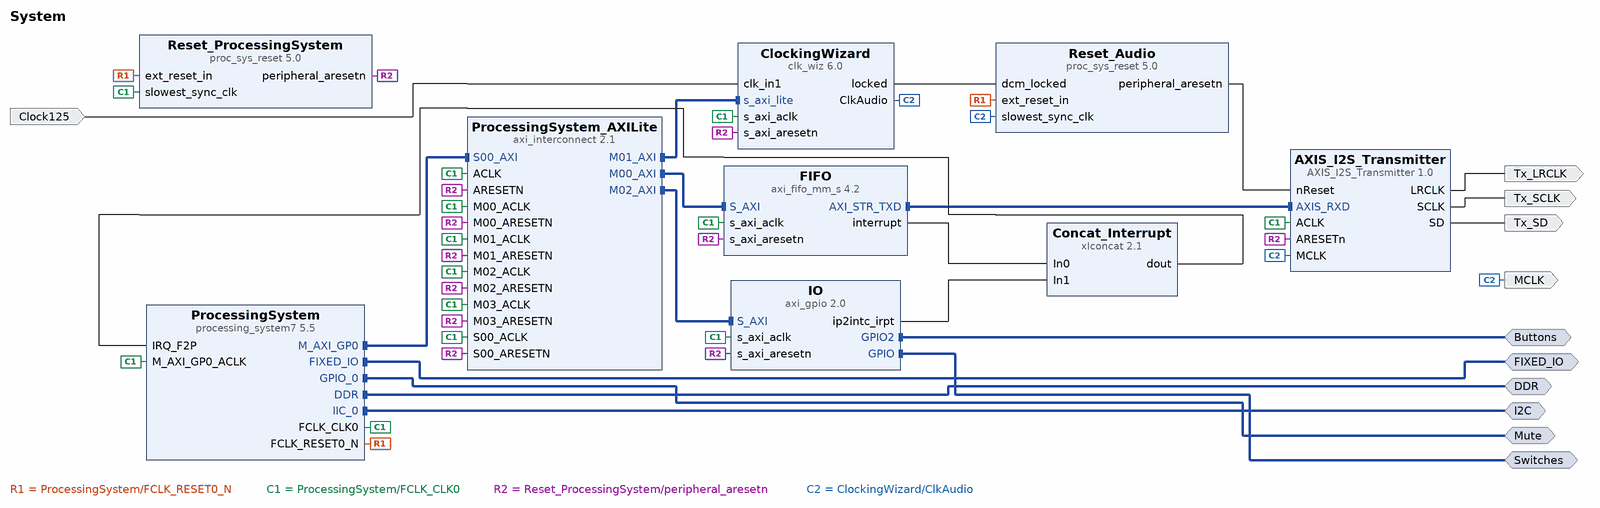
[diagram p0: block diagram of the top level]
# Vivado block design System, xc7z010clg400-1, Vivado 2019.2
create_bd_design System

create_bd_intf_port -mode Master -vlnv xilinx.com:interface:ddrx_rtl:1.0 DDR
create_bd_intf_port -mode Master -vlnv xilinx.com:display_processing_system7:fixedio_rtl:1.0 FIXED_IO
create_bd_intf_port -mode Master -vlnv xilinx.com:interface:gpio_rtl:1.0 Switches
create_bd_intf_port -mode Master -vlnv xilinx.com:interface:iic_rtl:1.0 I2C
create_bd_intf_port -mode Master -vlnv xilinx.com:interface:gpio_rtl:1.0 Buttons
create_bd_intf_port -mode Master -vlnv xilinx.com:interface:gpio_rtl:1.0 Mute
create_bd_port -dir I -type clk Clock125
set_property -dict {CONFIG.FREQ_HZ 125000000} [get_bd_ports Clock125]
create_bd_port -dir O Tx_LRCLK
create_bd_port -dir O Tx_SCLK
create_bd_port -dir O Tx_SD
create_bd_port -dir O -type clk MCLK
set_property -dict {CONFIG.FREQ_HZ 12286324} [get_bd_ports MCLK]

create_bd_cell -type ip -vlnv xilinx.com:ip:processing_system7:5.5 ProcessingSystem
set_property -dict [list \
  CONFIG.PCW_APU_PERIPHERAL_FREQMHZ 650.000000 \
  CONFIG.PCW_CRYSTAL_PERIPHERAL_FREQMHZ 50.000000 \
  CONFIG.PCW_ENET0_PERIPHERAL_ENABLE 0 \
  CONFIG.PCW_FCLK1_PERIPHERAL_CLKSRC {DDR PLL} \
  CONFIG.PCW_FCLK2_PERIPHERAL_CLKSRC {ARM PLL} \
  CONFIG.PCW_FPGA0_PERIPHERAL_FREQMHZ 100.000000 \
  CONFIG.PCW_FPGA1_PERIPHERAL_FREQMHZ 175.000000 \
  CONFIG.PCW_FPGA2_PERIPHERAL_FREQMHZ 12.288000 \
  CONFIG.PCW_FPGA3_PERIPHERAL_FREQMHZ 100.000000 \
  CONFIG.PCW_GPIO_EMIO_GPIO_ENABLE 1 \
  CONFIG.PCW_GPIO_EMIO_GPIO_IO 2 \
  CONFIG.PCW_GPIO_EMIO_GPIO_WIDTH 2 \
  CONFIG.PCW_GPIO_MIO_GPIO_ENABLE 1 \
  CONFIG.PCW_GPIO_MIO_GPIO_IO MIO \
  CONFIG.PCW_GPIO_PERIPHERAL_ENABLE 1 \
  CONFIG.PCW_I2C0_I2C0_IO EMIO \
  CONFIG.PCW_I2C0_PERIPHERAL_ENABLE 1 \
  CONFIG.PCW_I2C_PERIPHERAL_FREQMHZ 108.333336 \
  CONFIG.PCW_I2C_RESET_ENABLE 0 \
  CONFIG.PCW_IMPORT_BOARD_PRESET G:/Dropbox/Git/ZYBO/res/Zybo.xml \
  CONFIG.PCW_IRQ_F2P_INTR 1 \
  CONFIG.PCW_PRESET_BANK1_VOLTAGE {LVCMOS 1.8V} \
  CONFIG.PCW_QSPI_GRP_SINGLE_SS_ENABLE 1 \
  CONFIG.PCW_QSPI_GRP_SINGLE_SS_IO {MIO 1 .. 6} \
  CONFIG.PCW_QSPI_PERIPHERAL_ENABLE 1 \
  CONFIG.PCW_QSPI_QSPI_IO {MIO 1 .. 6} \
  CONFIG.PCW_SD0_GRP_CD_ENABLE 1 \
  CONFIG.PCW_SD0_GRP_CD_IO {MIO 47} \
  CONFIG.PCW_SD0_GRP_WP_ENABLE 1 \
  CONFIG.PCW_SD0_GRP_WP_IO EMIO \
  CONFIG.PCW_SD0_PERIPHERAL_ENABLE 1 \
  CONFIG.PCW_SD0_SD0_IO {MIO 40 .. 45} \
  CONFIG.PCW_SDIO_PERIPHERAL_FREQMHZ 50 \
  CONFIG.PCW_SINGLE_QSPI_DATA_MODE x4 \
  CONFIG.PCW_UART1_PERIPHERAL_ENABLE 1 \
  CONFIG.PCW_UART1_UART1_IO {MIO 48 .. 49} \
  CONFIG.PCW_UART_PERIPHERAL_FREQMHZ 50 \
  CONFIG.PCW_UIPARAM_DDR_FREQ_MHZ 525.000000 \
  CONFIG.PCW_UIPARAM_DDR_PARTNO {MT41K128M16 JT-125} \
  CONFIG.PCW_USB0_PERIPHERAL_ENABLE 0 \
  CONFIG.PCW_USB_RESET_ENABLE 0 \
  CONFIG.PCW_USE_FABRIC_INTERRUPT 1 \
] [get_bd_cells ProcessingSystem]
# 423 more settings of ProcessingSystem are not shown: defaults, MIO pin electricals, DDR timing, and values the tool derives
create_bd_cell -type ip -vlnv xilinx.com:ip:axi_fifo_mm_s:4.2 FIFO
set_property -dict {CONFIG.C_TX_FIFO_PE_THRESHOLD 5 CONFIG.C_USE_RX_DATA 0 CONFIG.C_USE_TX_CTRL 0} [get_bd_cells FIFO]
create_bd_cell -type ip -vlnv xilinx.com:ip:proc_sys_reset:5.0 Reset_ProcessingSystem
create_bd_cell -type ip -vlnv xilinx.com:ip:clk_wiz:6.0 ClockingWizard
set_property -dict [list \
  CONFIG.CLKOUT1_DRIVES BUFG \
  CONFIG.CLKOUT1_JITTER 273.836 \
  CONFIG.CLKOUT1_PHASE_ERROR 192.574 \
  CONFIG.CLKOUT1_REQUESTED_OUT_FREQ 12.288 \
  CONFIG.CLKOUT2_DRIVES BUFG \
  CONFIG.CLKOUT3_DRIVES BUFG \
  CONFIG.CLKOUT4_DRIVES BUFG \
  CONFIG.CLKOUT5_DRIVES BUFG \
  CONFIG.CLKOUT6_DRIVES BUFG \
  CONFIG.CLKOUT7_DRIVES BUFG \
  CONFIG.CLK_OUT1_PORT ClkAudio \
  CONFIG.MMCM_BANDWIDTH OPTIMIZED \
  CONFIG.MMCM_CLKFBOUT_MULT_F 23 \
  CONFIG.MMCM_CLKIN2_PERIOD 10.0 \
  CONFIG.MMCM_CLKOUT0_DIVIDE_F 78 \
  CONFIG.MMCM_COMPENSATION ZHOLD \
  CONFIG.MMCM_DIVCLK_DIVIDE 3 \
  CONFIG.PRIMITIVE PLL \
  CONFIG.RESET_PORT reset \
  CONFIG.RESET_TYPE ACTIVE_HIGH \
  CONFIG.USE_DYN_RECONFIG true \
  CONFIG.USE_RESET true \
] [get_bd_cells ClockingWizard]
create_bd_cell -type ip -vlnv xilinx.com:ip:proc_sys_reset:5.0 Reset_Audio
create_bd_cell -type ip -vlnv xilinx.com:ip:axi_interconnect:2.1 ProcessingSystem_AXILite
set_property -dict {CONFIG.NUM_MI 4} [get_bd_cells ProcessingSystem_AXILite]
create_bd_cell -type ip -vlnv xilinx.com:ip:axi_gpio:2.0 IO
set_property -dict [list \
  CONFIG.C_ALL_INPUTS 1 \
  CONFIG.C_ALL_INPUTS_2 1 \
  CONFIG.C_GPIO2_WIDTH 4 \
  CONFIG.C_GPIO_WIDTH 4 \
  CONFIG.C_INTERRUPT_PRESENT 1 \
  CONFIG.C_IS_DUAL 1 \
] [get_bd_cells IO]
create_bd_cell -type ip -vlnv xilinx.com:ip:xlconcat:2.1 Concat_Interrupt
create_bd_cell -type ip -vlnv www.Kampis-Elektroecke.com:Kampis-Elektroecke:AXIS_I2S_Transmitter:1.0 AXIS_I2S_Transmitter
set_property -dict {CONFIG.RATIO 8} [get_bd_cells AXIS_I2S_Transmitter]

# ---- connections ----

connect_bd_intf_net [get_bd_intf_ports FIXED_IO] [get_bd_intf_pins ProcessingSystem/FIXED_IO]
connect_bd_intf_net [get_bd_intf_ports Mute] [get_bd_intf_pins ProcessingSystem/GPIO_0]
connect_bd_intf_net -intf_net Mute_GPIO [get_bd_intf_ports Switches] [get_bd_intf_pins IO/GPIO]
connect_bd_intf_net [get_bd_intf_pins ProcessingSystem/M_AXI_GP0] [get_bd_intf_pins ProcessingSystem_AXILite/S00_AXI]
connect_bd_intf_net [get_bd_intf_pins ProcessingSystem_AXILite/M00_AXI] [get_bd_intf_pins FIFO/S_AXI]
connect_bd_intf_net [get_bd_intf_pins ProcessingSystem_AXILite/M02_AXI] [get_bd_intf_pins IO/S_AXI]
connect_bd_intf_net [get_bd_intf_ports I2C] [get_bd_intf_pins ProcessingSystem/IIC_0]
connect_bd_intf_net [get_bd_intf_pins FIFO/AXI_STR_TXD] [get_bd_intf_pins AXIS_I2S_Transmitter/AXIS_RXD]
connect_bd_intf_net [get_bd_intf_ports DDR] [get_bd_intf_pins ProcessingSystem/DDR]
connect_bd_intf_net -intf_net Mute_GPIO2 [get_bd_intf_ports Buttons] [get_bd_intf_pins IO/GPIO2]
connect_bd_intf_net [get_bd_intf_pins ProcessingSystem_AXILite/M01_AXI] [get_bd_intf_pins ClockingWizard/s_axi_lite]
connect_bd_net -net clk_in1_0_1 [get_bd_ports Clock125] [get_bd_pins ClockingWizard/clk_in1]
connect_bd_net [get_bd_pins ProcessingSystem/FCLK_RESET0_N] [get_bd_pins Reset_ProcessingSystem/ext_reset_in] [get_bd_pins Reset_Audio/ext_reset_in]
connect_bd_net -net AXIS_I2S_Transmitter_0_LRCLK [get_bd_pins AXIS_I2S_Transmitter/LRCLK] [get_bd_ports Tx_LRCLK]
connect_bd_net -net AXIS_I2S_Transmitter_0_SCLK [get_bd_pins AXIS_I2S_Transmitter/SCLK] [get_bd_ports Tx_SCLK]
connect_bd_net -net AXIS_I2S_Transmitter_0_SD [get_bd_pins AXIS_I2S_Transmitter/SD] [get_bd_ports Tx_SD]
connect_bd_net [get_bd_pins Reset_Audio/peripheral_aresetn] [get_bd_pins AXIS_I2S_Transmitter/nReset]
connect_bd_net [get_bd_pins ProcessingSystem/FCLK_CLK0] \
  [get_bd_pins FIFO/s_axi_aclk] [get_bd_pins Reset_ProcessingSystem/slowest_sync_clk] \
  [get_bd_pins ProcessingSystem_AXILite/M00_ACLK] [get_bd_pins ProcessingSystem/M_AXI_GP0_ACLK] \
  [get_bd_pins ProcessingSystem_AXILite/S00_ACLK] [get_bd_pins ProcessingSystem_AXILite/ACLK] \
  [get_bd_pins ClockingWizard/s_axi_aclk] [get_bd_pins ProcessingSystem_AXILite/M01_ACLK] [get_bd_pins IO/s_axi_aclk] \
  [get_bd_pins ProcessingSystem_AXILite/M02_ACLK] [get_bd_pins ProcessingSystem_AXILite/M03_ACLK] \
  [get_bd_pins AXIS_I2S_Transmitter/ACLK]
connect_bd_net [get_bd_pins Reset_ProcessingSystem/peripheral_aresetn] \
  [get_bd_pins FIFO/s_axi_aresetn] [get_bd_pins ProcessingSystem_AXILite/M00_ARESETN] \
  [get_bd_pins ProcessingSystem_AXILite/S00_ARESETN] [get_bd_pins ProcessingSystem_AXILite/ARESETN] \
  [get_bd_pins ClockingWizard/s_axi_aresetn] [get_bd_pins ProcessingSystem_AXILite/M01_ARESETN] \
  [get_bd_pins IO/s_axi_aresetn] [get_bd_pins ProcessingSystem_AXILite/M02_ARESETN] \
  [get_bd_pins ProcessingSystem_AXILite/M03_ARESETN] [get_bd_pins AXIS_I2S_Transmitter/ARESETn]
connect_bd_net [get_bd_pins ClockingWizard/ClkAudio] \
  [get_bd_ports MCLK] [get_bd_pins Reset_Audio/slowest_sync_clk] [get_bd_pins AXIS_I2S_Transmitter/MCLK]
connect_bd_net [get_bd_pins ClockingWizard/locked] [get_bd_pins Reset_Audio/dcm_locked]
connect_bd_net [get_bd_pins Concat_Interrupt/dout] [get_bd_pins ProcessingSystem/IRQ_F2P]
connect_bd_net [get_bd_pins FIFO/interrupt] [get_bd_pins Concat_Interrupt/In0]
connect_bd_net -net Mute_ip2intc_irpt [get_bd_pins IO/ip2intc_irpt] [get_bd_pins Concat_Interrupt/In1]

# ---- address map ----
assign_bd_address -offset 0x41200000 -range 64K -target_address_space [get_bd_addr_spaces ProcessingSystem/Data] [get_bd_addr_segs IO/S_AXI/Reg]
assign_bd_address -offset 0x43C00000 -range 64K -target_address_space [get_bd_addr_spaces ProcessingSystem/Data] [get_bd_addr_segs FIFO/S_AXI/Mem0]
assign_bd_address -offset 0x43C10000 -range 64K -target_address_space [get_bd_addr_spaces ProcessingSystem/Data] [get_bd_addr_segs ClockingWizard/s_axi_lite/Reg]

validate_bd_design
save_bd_design
